# EAGLE schematic LV (EAGLE 9.5.0)
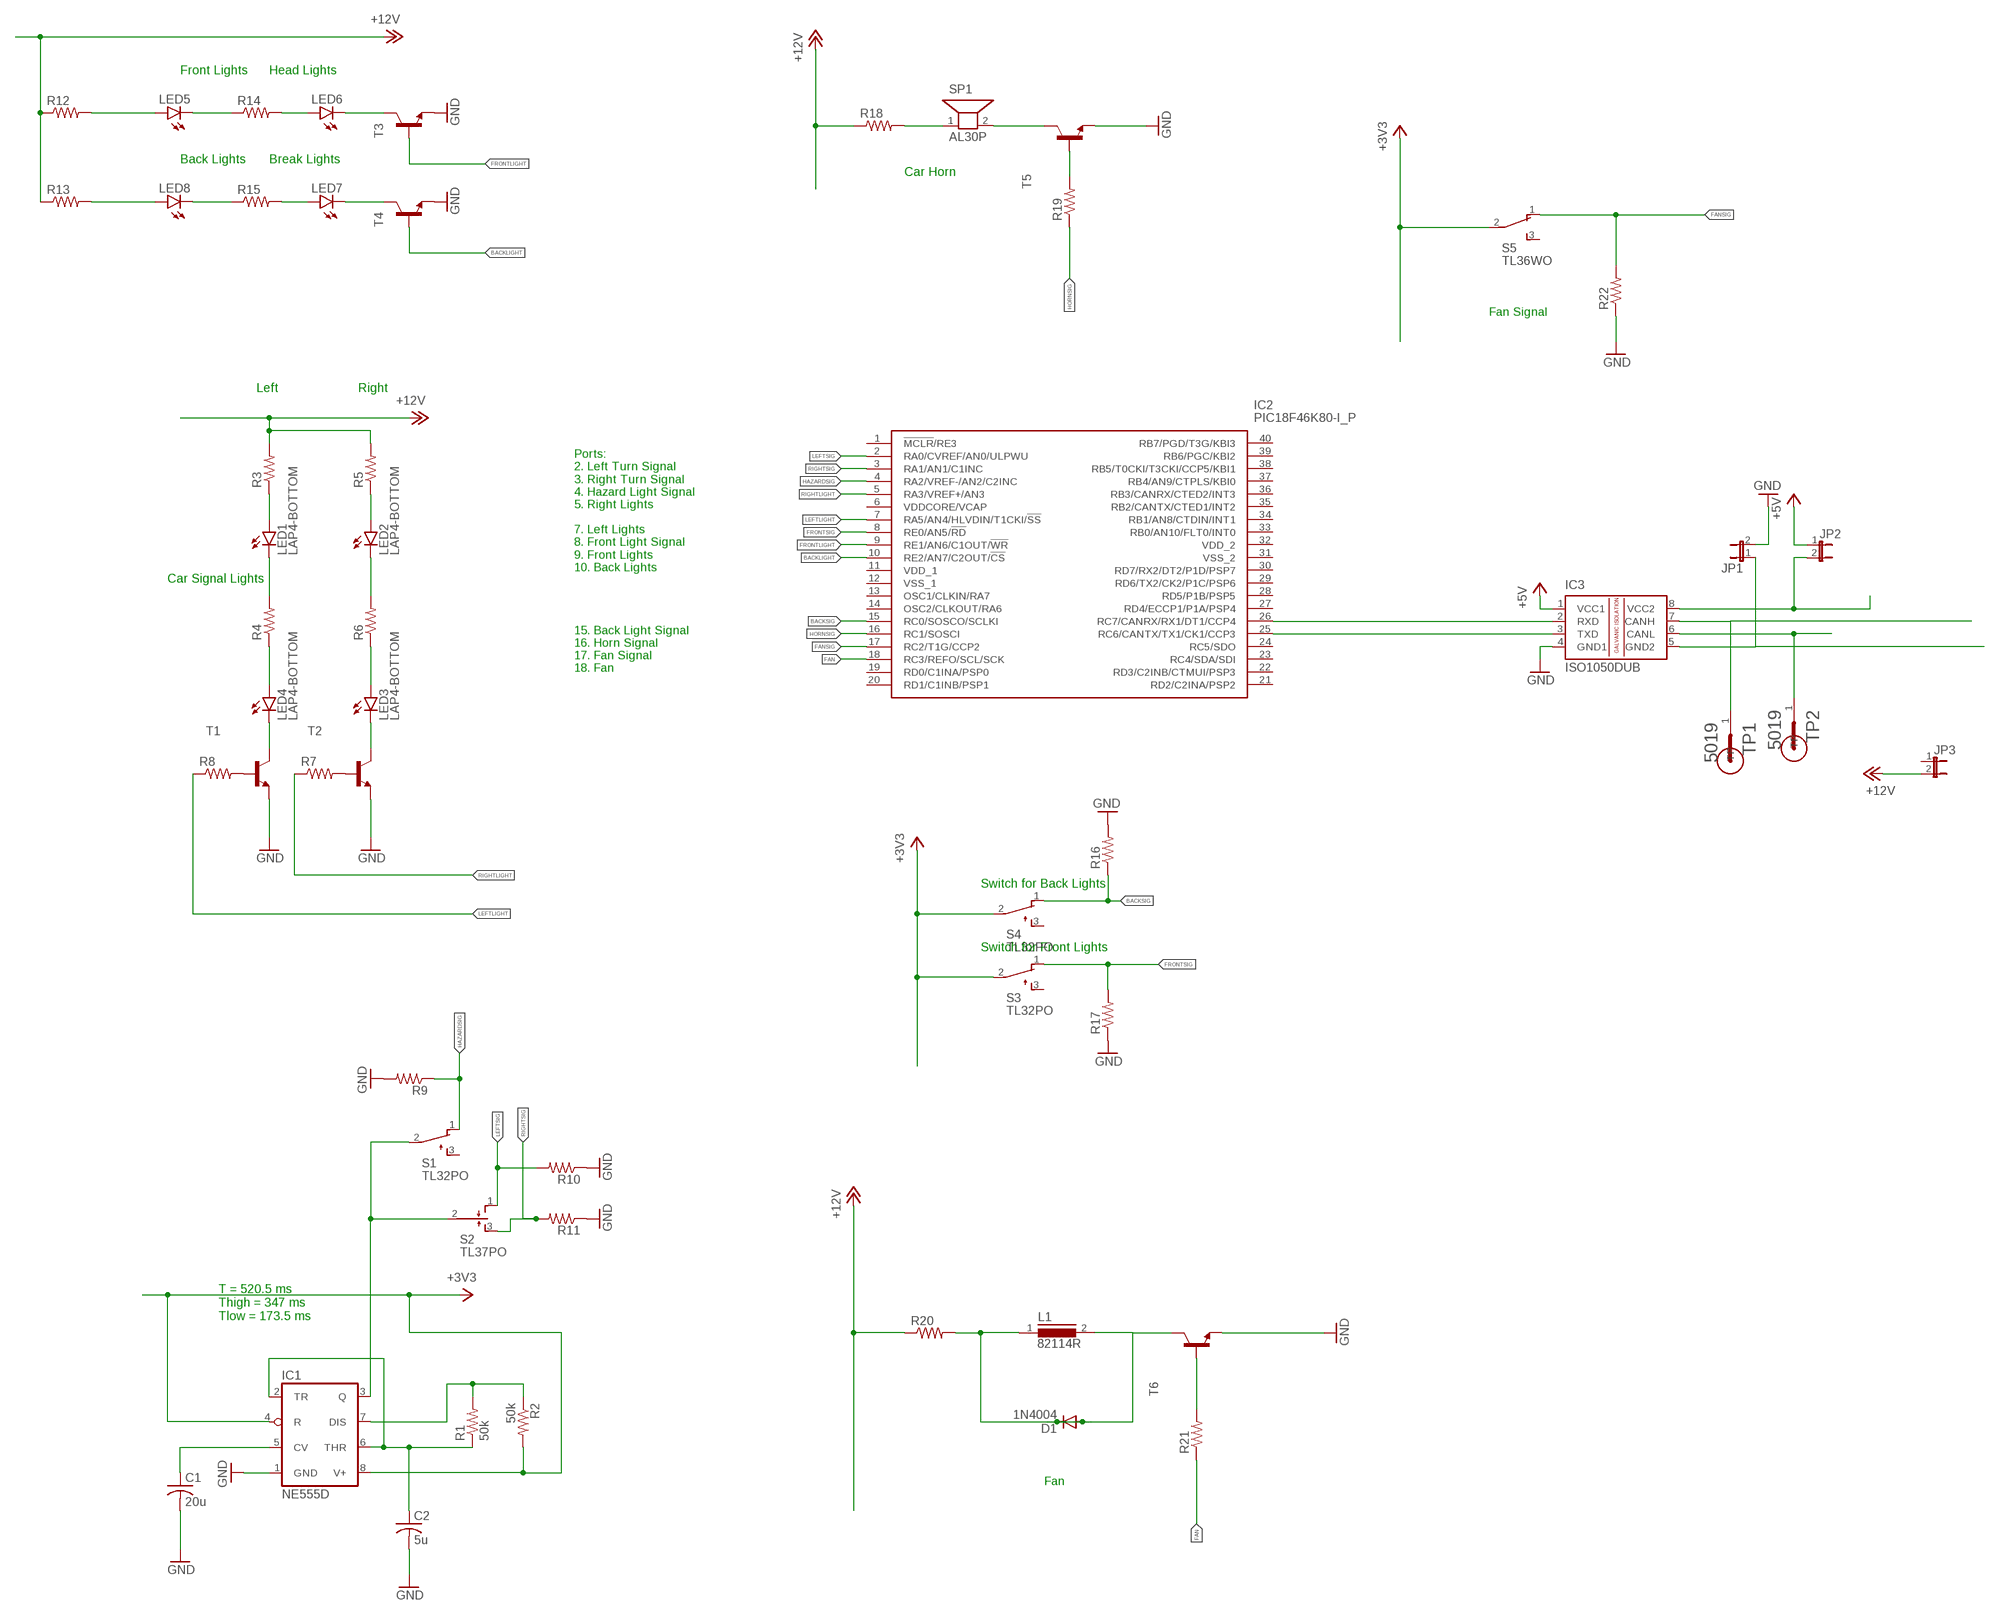
[diagram p0: schematic, sheet 1]

## Parts
C1  20u  C-US025-024X044  [C025-024X044]
C2  5u  C-US025-024X044  [C025-024X044]
D1  1N4004  [DO41-10]
IC1  NE555D  [SO08]
IC2  PIC18F46K80-I_P  [DIP1778W58P254L5175H635Q40N]
IC3  ISO1050DUB  [DUB-R-PDSO-G8]
JP1  JP1E  [JP1]
JP2  JP1E  [JP1]
JP3  JP1E  [JP1]
L1  82114R  [82114R]
LED1  LAP4-BOTTOM  [P47F-BOTTOM]
LED2  LAP4-BOTTOM  [P47F-BOTTOM]
LED3  LAP4-BOTTOM  [P47F-BOTTOM]
LED4  LAP4-BOTTOM  [P47F-BOTTOM]
LED5  LED  [SMARTLED-TTW]
LED6  LED  [SMARTLED-TTW]
LED7  LED  [SMARTLED-TTW]
LED8  LED  [SMARTLED-TTW]
R1  50k  R-US_0204/7  [0204/7]
R2  50k  R-US_0204/7  [0204/7]
R3  R-US_0204/7  [0204/7]
R4  R-US_0204/7  [0204/7]
R5  R-US_0204/7  [0204/7]
R6  R-US_0204/7  [0204/7]
R7  R-US_0204/7  [0204/7]
R8  R-US_0204/7  [0204/7]
R9  R-US_0204/7  [0204/7]
R10  R-US_0204/7  [0204/7]
R11  R-US_0204/7  [0204/7]
R12  R-US_0204/7  [0204/7]
R13  R-US_0204/7  [0204/7]
R14  R-US_0204/7  [0204/7]
R15  R-US_0204/7  [0204/7]
R16  R-US_0204/7  [0204/7]
R17  R-US_0204/7  [0204/7]
R18  R-US_0204/7  [0204/7]
R19  R-US_0204/7  [0204/7]
R20  R-US_0204/7  [0204/7]
R21  R-US_0204/7  [0204/7]
R22  R-US_0204/7  [0204/7]
S1  TL32PO  [TL3XPO]
S2  TL37PO  [TL3XPO]
S3  TL32PO  [TL3XPO]
S4  TL32PO  [TL3XPO]
S5  TL36WO  [TL3XWO]
SP1  AL30P  [AL30P]
T1  -NPN-SOT23-EBC  [SOT23-EBC]
T2  -NPN-SOT23-EBC  [SOT23-EBC]
T3  -NPN-SOT23-EBC  [SOT23-EBC]
T4  -NPN-SOT23-EBC  [SOT23-EBC]
T5  -NPN-TO92  [TO92]
T6  -NPN-TO92  [TO92]
TP1  5019  [TP380X203]
TP2  5019  [TP380X203]

## Nets
+3V3: IC1.4(R) IC1.8(V+) R2.2 S3.2(P) S4.2(P) S5.2(P)
+5V: IC3.1(VCC1) JP2.1
+12V: JP3.2 R3.2 R5.2 R12.1 R13.1 R18.1 R20.1
BACKLIGHT: IC2.10(RE2/AN7/C2OUT/!CS) T4.B
BACKSIG: IC2.15(RC0/SOSCO/SCLKI) R16.1 S4.1(O)
FAN: IC2.18(RC3/REFO/SCL/SCK) R21.1
FANSIG: IC2.17(RC2/T1G/CCP2) R22.2 S5.1(O)
FRONTLIGHT: IC2.9(RE1/AN6/C1OUT/!WR) T3.B
FRONTSIG: IC2.8(RE0/AN5/!RD) R17.2 S3.1(O)
GND: C1.2 C2.2 IC1.1(GND) IC3.4(GND1) JP1.2 R9.2 R10.1 R11.1 R16.2 R17.1 R22.1 T1.E T2.E T3.E T4.E T5.1(E) T6.1(E)
HAZARDSIG: IC2.4(RA2/VREF-/AN2/C2INC) R9.1 S1.1(O)
HORNSIG: IC2.16(RC1/SOSCI) R19.1
LEFTLIGHT: IC2.7(RA5/AN4/HLVDIN/T1CKI/!SS) R8.1
LEFTSIG: IC2.2(RA0/CVREF/AN0/ULPWU) R10.2 S2.1(O)
N$1: C2.1 IC1.2(TR) IC1.6(THR) R1.1
N$2: IC1.7(DIS) R1.2 R2.1
N$3: IC1.3(Q) S1.2(P) S2.2(P)
N$4: C1.1 IC1.5(CV)
N$5: LED1.A R3.1
N$6: LED1.C R4.2
N$7: LED4.A R4.1
N$8: LED2.A R5.1
N$9: LED2.C R6.2
N$10: LED3.A R6.1
N$11: LED4.C T1.C
N$12: LED3.C T2.C
N$13: R7.2 T2.B
N$14: R8.2 T1.B
N$15: R21.2 T6.2(B)
N$16: D1.A D1.C L1.1 L1.2 R20.2 T6.3(C)
N$17: IC2.26(RC7/CANRX/RX1/DT1/CCP4) IC3.2(RXD)
N$18: IC2.25(RC6/CANTX/TX1/CK1/CCP3) IC3.3(TXD)
N$20: LED5.A@1(A) R12.2
N$21: LED5.C@1(C) R14.1
N$22: LED6.A@1(A) R14.2
N$23: LED8.A@1(A) R13.2
N$24: LED8.C@1(C) R15.1
N$25: LED7.A@1(A) R15.2
N$26: LED6.C@1(C) T3.C
N$27: LED7.C@1(C) T4.C
N$28: IC3.5(GND2) JP1.1
N$29: IC3.7(CANH) TP1.1(TP)
N$30: IC3.6(CANL) TP2.1(TP)
N$31: IC3.8(VCC2) JP2.2
N$32: R18.2 SP1.1
N$33: SP1.2 T5.3(C)
N$34: R19.2 T5.2(B)
RIGHTLIGHT: IC2.5(RA3/VREF+/AN3) R7.1
RIGHTSIG: IC2.3(RA1/AN1/C1INC) R11.2 S2.3(S)
Unconnected: IC2.1(!MCLR!/RE3) IC2.6(VDDCORE/VCAP) IC2.11(VDD_1) IC2.12(VSS_1) IC2.13(OSC1/CLKIN/RA7) IC2.14(OSC2/CLKOUT/RA6) IC2.19(RD0/C1INA/PSP0) IC2.20(RD1/C1INB/PSP1) IC2.21(RD2/C2INA/PSP2) IC2.22(RD3/C2INB/CTMUI/PSP3) IC2.23(RC4/SDA/SDI) IC2.24(RC5/SDO) IC2.27(RD4/ECCP1/P1A/PSP4) IC2.28(RD5/P1B/PSP5) IC2.29(RD6/TX2/CK2/P1C/PSP6) IC2.30(RD7/RX2/DT2/P1D/PSP7) IC2.31(VSS_2) IC2.32(VDD_2) IC2.33(RB0/AN10/FLT0/INT0) IC2.34(RB1/AN8/CTDIN/INT1) IC2.35(RB2/CANTX/CTED1/INT2) IC2.36(RB3/CANRX/CTED2/INT3) IC2.37(RB4/AN9/CTPLS/KBI0) IC2.38(RB5/T0CKI/T3CKI/CCP5/KBI1) IC2.39(RB6/PGC/KBI2) IC2.40(RB7/PGD/T3G/KBI3) JP3.1 S1.3(S) S3.3(S) S4.3(S) S5.3(S)

## Notes on the sheet
- Front Lights | Head Lights
- Back Lights | Break Lights
- Car Horn
- Fan Signal
- Left | Right
- Car Signal Lights
- Ports:
  2. Left Turn Signal
  3. Right Turn Signal
  4. Hazard Light Signal
  5. Right Lights
  
  7. Left Lights
  8. Front Light Signal
  9. Front Lights
  10. Back Lights
  
  
  
  
  15. Back Light Signal
  16. Horn Signal
  17. Fan Signal
  18. Fan
- Switch for Back Lights
- Switch for Front Lights
- T = 520.5 ms
  Thigh = 347 ms
  Tlow = 173.5 ms
- Fan

## Library data of the parts
C1 C2 = rcl:C-US: CAPACITOR, American symbol; SPICEPREFIX: C
D1 = diode:1N4004: DIODE general purpose rectifier, 1 A
IC1 = linear:*555: TIMER
IC2 = PIC18F46K80-I_P:PIC18F46K80-I_P: Microchip PIC18F46K80-I/P, 8bit PIC Microcontroller, 64MHz, 64 kB Flash, 40-Pin PDIP Source: Datasheet <http://uk.rs-online.com/web/p/products/7154687P>; DESCRIPTION: Microchip PIC18F46K80-I/P, 8bit PIC Microcontroller, 64MHz, 64 kB Flash, 40-Pin PDIP; HEIGHT: 6.35mm; MANUFACTURER_NAME: Microchip; MANUFACTURER_PART_NUMBER: PIC18F46K80-I/P; RS_PART_NUMBER: 7154687P; RS_PRICE-STOCK: http://uk.rs-online.com/web/p/products/7154687P
IC3 = texas:ISO1050: ISOLATED CAN TRANSCEIVER Source: http://focus.ti.com/lit/ds/symlink/iso1050.pdf; MPN: ISO1050DUBR; OC_FARNELL: 1755712; OC_NEWARK: 14R9899
JP1-JP3 = jumper:JP1E: JUMPER
L1 = inductors:82114R: INDUCTOR; SPICEPREFIX: L
LED1-LED4 = led:*P4: PointLED® Enhanced Thinfilm LED TOP & BOTTOM mount LS P47F, LR P47F, LA P47F, LY P47F, LT P4SG, LB P4SG, LW P4SG Source: http://catalog.osram-os.com .. LA_LR_LS_LY_P47F_Pb_free.pdf
LED5-LED8 = led:LED: LED OSRAM: - CHIPLED LG R971, LG N971, LY N971, LG Q971, LY Q971, LO R971, LY R971 LH N974, LH R974 LS Q976, LO Q976, LY Q976 LO Q996 - Hyper CHIPLED LW Q18S LB Q993, LB Q99A, LB R99A - SideLED LS A670, LO A670, LY A670, LG A670, LP A670 LB A673, LV A673, LT A673, LW A673 LH A674 LY A675 LS A676, LA A676, LO A676, LY A676, LW A676 LS A679, LY A679, LG A679 - Hyper Micro SIDELED® LS Y876, LA Y876, LO Y876, LY Y876 LT Y87S - SmartLED LW L88C, LW L88S LB L89C, LB L89S, LG L890 LS L89K, LO L89K, LY L89K LS L896, LA L896, LO L896, LY L896 - TOPLED LS T670, LO T670, LY T670, LG T670, LP T670 LSG T670, LSP T670, LSY T670, LOP T670, LYG T670 LG T671, LOG T671, LSG T671 LB T673, LV T673, LT T673, LW T673 LH T674 LS T676, LA T676, LO T676, LY T676, LB T676, LH T676, LSB T676, LW T676 LB T67C, LV T67C, LT T67C, LS T67K, LO T67K, LY T67K, LW E67C LS E67B, LA E67B, LO E67B, LY E67B, LB E67C, LV E67C, LT E67C LW T67C LS T679, LY T679, LG T679 LS T770, LO T770, LY T770, LG T770, LP T770 LB T773, LV T773, LT T773, LW T773 LH T774 LS E675, LA E675, LY E675, LS T675 LS T776, LA T776, LO T776, LY T776, LB T776 LHGB T686 LT T68C, LB T68C - Hyper Mini TOPLED® LB M676 - Mini TOPLED Santana® LG M470 LS M47K, LO M47K, LY M47K Source: http://www.osram.convergy.de LUXEON: - LUMILED® LXK2-PW12-R00, LXK2-PW12-S00, LXK2-PW14-U00, LXK2-PW14-V00 LXK2-PM12-R00, LXK2-PM12-S00, LXK2-PM14-U00 LXK2-PE12-Q00, LXK2-PE12-R00, LXK2-PE12-S00, LXK2-PE14-T00, LXK2-PE14-U00 LXK2-PB12-K00, LXK2-PB12-L00, LXK2-PB12-M00, LXK2-PB14-N00, LXK2-PB14-P00, LXK2-PB14-Q00 LXK2-PR12-L00, LXK2-PR12-M00, LXK2-PR14-Q00, LXK2-PR14-R00 LXK2-PD12-Q00, LXK2-PD12-R00, LXK2-PD12-S00 LXK2-PH12-R00, LXK2-PH12-S00 LXK2-PL12-P00, LXK2-PL12-Q00, LXK2-PL12-R00 Source: www.luxeon.com KINGBRIGHT: KA-3528ASYC Source: www.kingbright.com
R1-R22 = rcl:R-US_: RESISTOR, American symbol; SPICEPREFIX: R
S1 S3 S4 = switch:TL32PO: TINY SWITCH ON - MOM Source: http://www2.produktinfo.conrad.com/datenblaetter/700000-724999/705152-da-01-de-Subminiaturschalter_TL_36YO.pdf
S2 = switch:TL37PO: TINY SWITCH MOM OFF MOM Source: http://www2.produktinfo.conrad.com/datenblaetter/700000-724999/705152-da-01-de-Subminiaturschalter_TL_36YO.pdf
S5 = switch:TL36WO: TINY SWITCH ON - ON Source: http://www2.produktinfo.conrad.com/datenblaetter/700000-724999/705152-da-01-de-Subminiaturschalter_TL_36WO.pdf
SP1 = buzzer:AL30P: SPEAKER Source: Buerklin; OC_FARNELL: unknown; OC_NEWARK: unknown
T1-T4 = transistor:*-NPN-: NPN Transistror BF959 corrected 2008.03.06
T5 T6 = transistor-neu-to92:*-NPN-: NPN Transistror BF959 corrected 2008.03.06
TP1 TP2 = 5019:5019: Test Point, Compact, Surface Mount; AVAILABILITY: Unavailable; DESCRIPTION: PC Test Point, Miniature Phosphor Bronze, Silver Plating Surface Mount Mounting Type; MF: Keystone Electronics; MP: 5019; PACKAGE: 2010 Keystone; PRICE: None